# EAGLE design untitled (EAGLE 7.3.2)
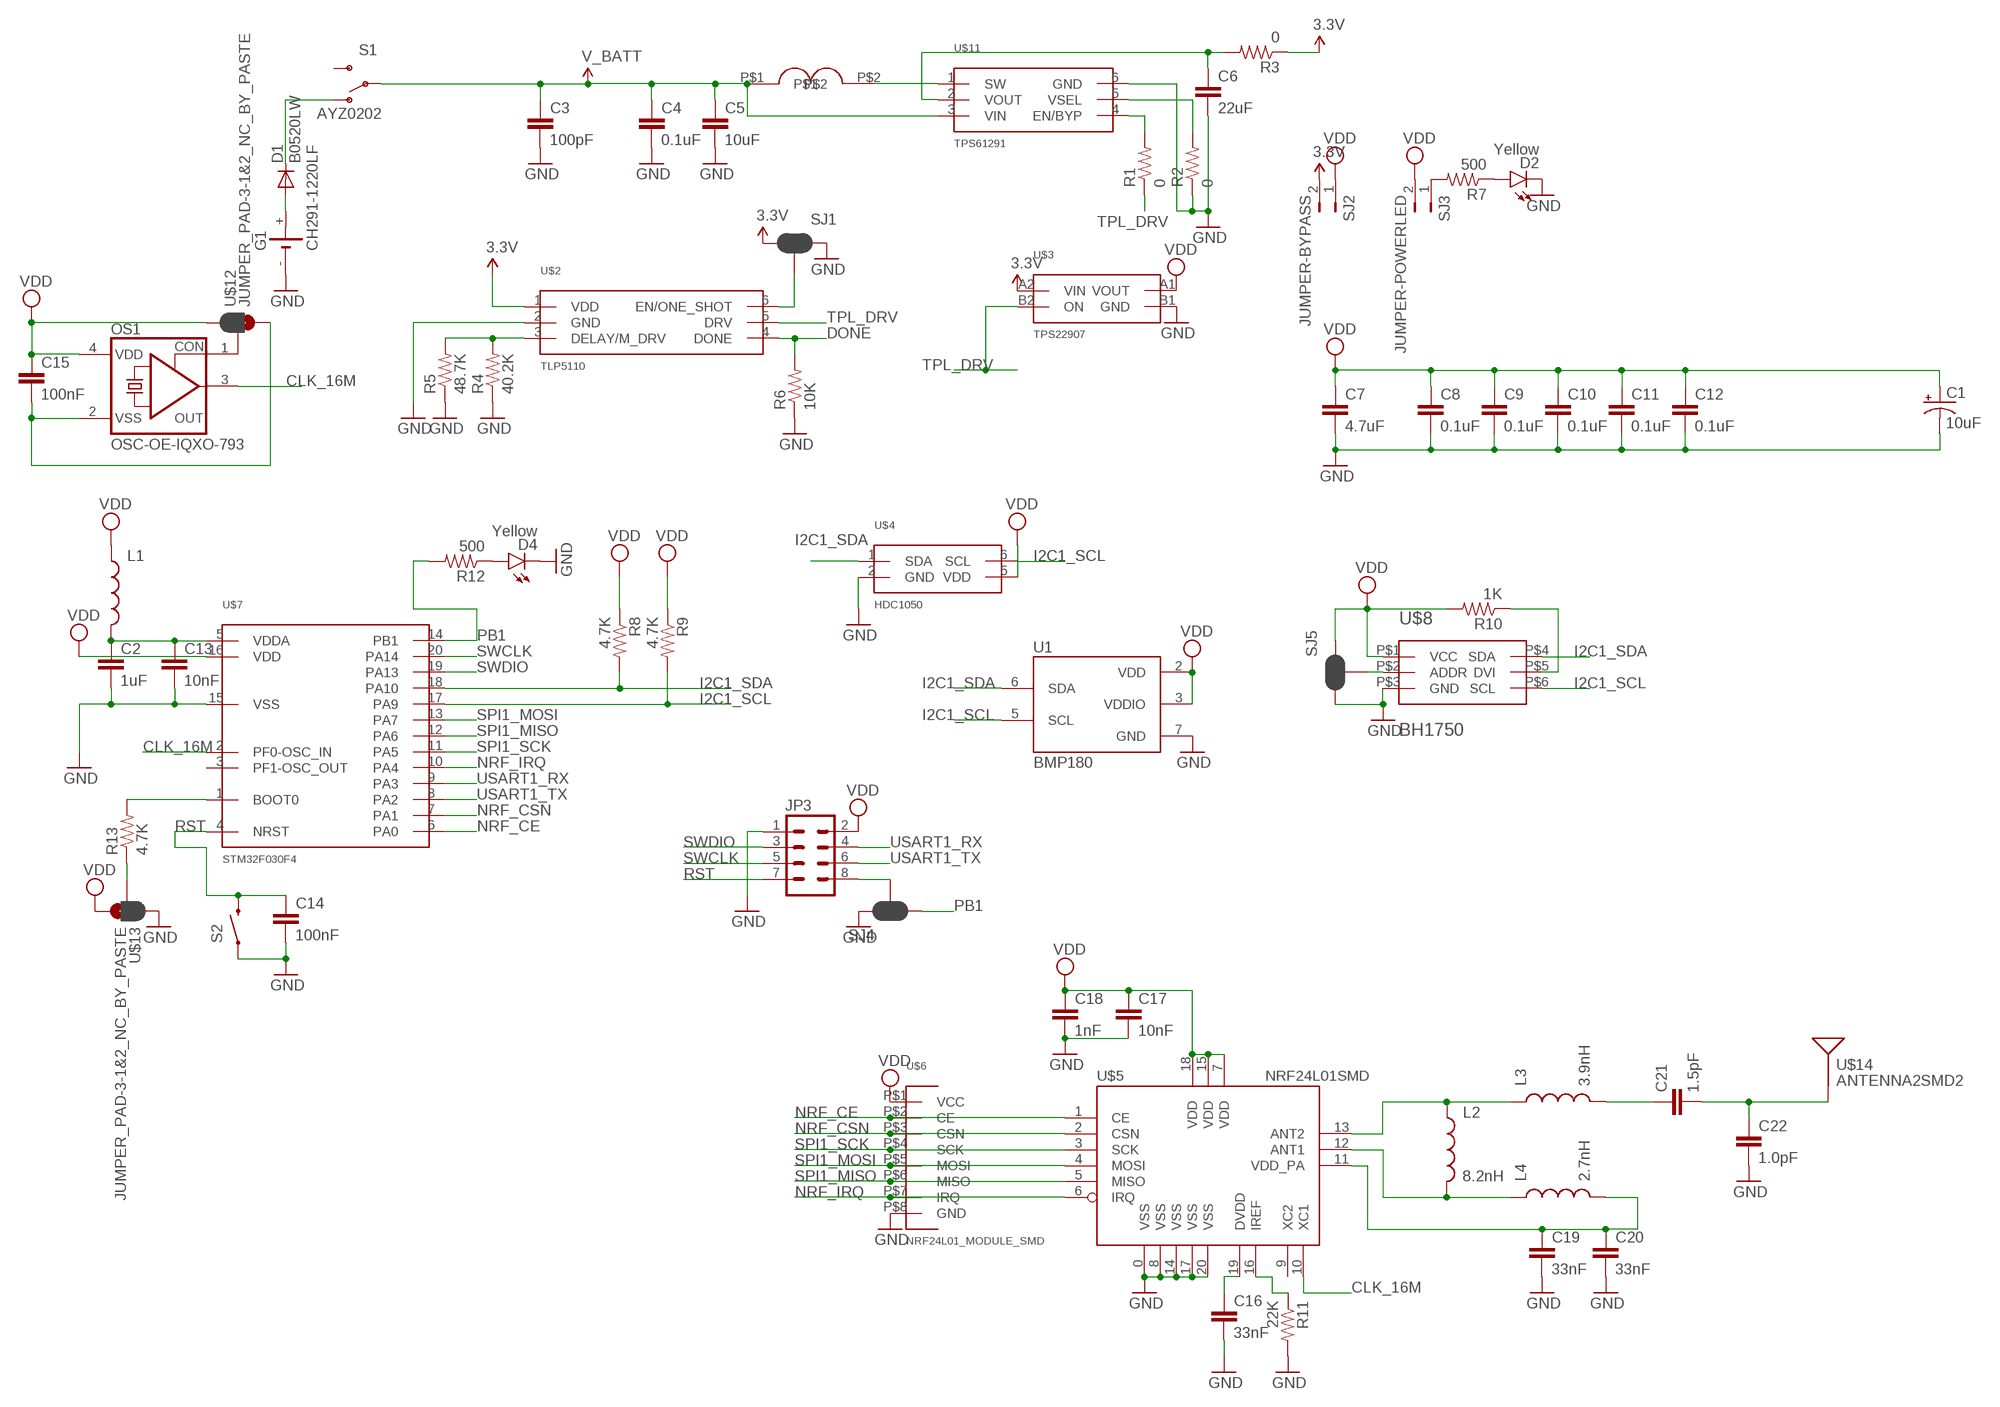
[diagram p0: schematic, sheet 1]

## Parts
C1  10uF  10UF-16V-10%(TANT)  [EIA3216]
C2  1uF  0.1UF-25V-5%(0603)  [0603-CAP]
C3  100pF  100PF-50V-5%(0603)  [0603-CAP]
C4  0.1uF  100PF-50V-5%(0603)  [0603-CAP]
C5  10uF  100PF-50V-5%(0603)  [0603-CAP]
C6  22uF  100PF-50V-5%(0603)  [0603-CAP]
C7  4.7uF  1.0UF-16V-10%(0603)  [0603-CAP]
C8  0.1uF  0.1UF-25V-5%(0603)  [0603-CAP]
C9  0.1uF  0.1UF-25V-5%(0603)  [0603-CAP]
C10  0.1uF  0.1UF-25V-5%(0603)  [0603-CAP]
C11  0.1uF  0.1UF-25V-5%(0603)  [0603-CAP]
C12  0.1uF  0.1UF-25V-5%(0603)  [0603-CAP]
C13  10nF  0.1UF-25V-5%(0603)  [0603-CAP]
C14  100nF  0.1UF-25V-5%(0603)  [0603-CAP]
C15  100nF  0.1UF-25V-5%(0603)  [0603-CAP]
C16  33nF  0.1UF-25V-5%(0603)  [0603-CAP]
C17  10nF  0.1UF-25V-5%(0603)  [0603-CAP]
C18  1nF  0.1UF-25V-5%(0603)  [0603-CAP]
C19  33nF  0.1UF-25V-5%(0603)  [0603-CAP]
C20  33nF  0.1UF-25V-5%(0603)  [0603-CAP]
C21  1.5pF  0.1UF-25V-5%(0603)  [0603-CAP]
C22  1.0pF  0.1UF-25V-5%(0603)  [0603-CAP]
D1  B0520LW  CGRM4001-G  [SOD-123_MINI-SMA]
D2  Yellow  LED-YELLOW0603  [LED-0603]
D4  Yellow  LED-YELLOW0603  [LED-0603]
G1  CH291-1220LF  [CH291-1220LF]
JP3  M04X2SMD  [2X4_SMD]
L1  INDUCTOR0603  [0603]
L2  8.2nH  INDUCTOR0603  [0603]
L3  3.9nH  INDUCTOR0603  [0603]
L4  2.7nH  INDUCTOR0603  [0603]
OS1  OSC-OE-IQXO-793  [2.5X2-4-PAD]
R1  0  1.5KOHM-1/10W-1%(0603)  [0603]
R2  0  1.5KOHM-1/10W-1%(0603)  [0603]
R3  0  1.5KOHM-1/10W-1%(0603)  [0603]
R4  40.2K  0.22OHM-1/4W-1%(0805)  [0805]
R5  48.7K  0.22OHM-1/4W-1%(0805)  [0805]
R6  10K  1.5KOHM-1/10W-1%(0603)  [0603]
R7  500  1.5KOHM-1/10W-1%(0603)  [0603]
R8  4.7K  1.5KOHM-1/10W-1%(0603)  [0603]
R9  4.7K  1.5KOHM-1/10W-1%(0603)  [0603]
R10  1K  1.5KOHM-1/10W-1%(0603)  [0603]
R11  22K  1.5KOHM-1/10W-1%(0603)  [0603]
R12  500  1.5KOHM-1/10W-1%(0603)  [0603]
R13  4.7K  1.5KOHM-1/10W-1%(0603)  [0603]
S1  AYZ0202  SWITCH-SPDTSMD  [AYZ0202]
S2  SWITCH-MOMENTARY-2SMD-REDUNDANT  [TACTILE-SWITCH-SMD]
SJ1  JUMPER-PAD-3-NC_BY_PASTE  [PAD-JUMPER-3-NC_BY_PASTE_YES_SILK_FULL_BOX]
SJ2  JUMPER-BYPASS  JUMPER-PTH-2-NO  [PTH-JUMPER-2-NO_NO_SILK]
SJ3  JUMPER-POWERLED  JUMPER-PTH-2-NO  [PTH-JUMPER-2-NO_NO_SILK]
SJ4  JUMPER-PAD-3-NC_BY_PASTE  [PAD-JUMPER-3-NC_BY_PASTE_YES_SILK_FULL_BOX]
SJ5  JUMPER-PAD-3-NC_BY_PASTE  [PAD-JUMPER-3-NC_BY_PASTE_YES_SILK_FULL_BOX]
U1  BMP180  [BMP180]
U$1  SWPA4018S3R3MT  [SWPA4018S]
U$2  TLP5110  [DDC(R-PDSO-G6)]
U$3  TPS22907  [YZT(S-XBGA-N4)]
U$4  HDC1050  [DMB(S-PWSON-N6)]
U$5  NRF24L01SMD  [QFN20]
U$6  NRF24L01_MODULE_SMD  [M08-1.27]
U$7  STM32F030F4  [TSSOP20]
U$8  BH1750  [WSOF-6]
U$11  TPS61291  [DRV(S-PWSON-N6)]
U$12  JUMPER_PAD-3-1&2_NC_BY_PASTE  [PAD-HUMPER-3-1&2_NC_BY_PASTE_YES_SILK_FULL_BOX]
U$13  JUMPER_PAD-3-1&2_NC_BY_PASTE  [PAD-HUMPER-3-1&2_NC_BY_PASTE_YES_SILK_FULL_BOX]
U$14  ANTENNA2SMD2  [ANTENNA-CHIP3]

## Nets
3.3V: R3.1 SJ1.1 SJ2.2 U$2.1(VDD) U$3.A2(VIN)
CLK_16M: OS1.3(OUT) U$5.10(XC1) U$7.2(PF0-OSC_IN)
DONE: R6.2 U$2.4(DONE)
GND: C1.C(-) C2.2 C3.2 C4.2 C5.2 C6.2 C7.2 C8.2 C9.2 C10.2 C11.2 C12.2 C13.2 C14.2 C16.2 C17.2 C18.2 C19.2 C20.2 C22.2 D2.C D4.C G1.- JP3.1 R2.1 R4.1 R5.1 R6.1 R11.2 S2.1 S2.2 SJ1.3 SJ4.3 SJ5.1 U1.7(GND) U$2.2(GND) U$3.B1(GND) U$4.2(GND) U$5.0(VSS) U$5.8(VSS) U$5.14(VSS) U$5.17(VSS) U$5.20(VSS) U$6.P$8(GND) U$7.15(VSS) U$8.P$3(GND) U$11.6(GND) U$13.1
I2C1_SCL: R9.2 U1.5(SCL) U$4.6(SCL) U$7.17(PA9) U$8.P$6(SCL)
I2C1_SDA: R8.2 U1.6(SDA) U$4.1(SDA) U$7.18(PA10) U$8.P$4(SDA)
MESH: C1.A(+) C7.1 C8.1 C9.1 C10.1 C11.1 C12.1 R8.1 R9.1 R10.2 SJ2.1 SJ3.2 SJ5.3 U1.2(VDD) U1.3(VDDIO) U$6.P$1(VCC) U$8.P$1(VCC) ; supply symbol labelled VDD
N$1: D1.A G1.+
N$2: D1.C S1.1(O)
N$3: U$1.P$2 U$11.1(SW)
N$4: C6.1 R3.2 U$11.2(VOUT)
N$5: R1.2 U$11.4(EN/BYP)
N$6: R2.2 U$11.5(VSEL)
N$7: R4.2 R5.2 U$2.3(DELAY/M_DRV)
N$8: R7.2 SJ3.1
N$9: D2.A R7.1
N$10: SJ1.2 U$2.6(EN/ONE_SHOT)
N$11: L2.1 L3.1 U$5.13(ANT2)
N$12: SJ5.2 U$8.P$2(ADDR)
N$13: R10.1 U$8.P$5(DVI)
N$14: L2.2 L4.1 U$5.12(ANT1)
N$15: D4.A R12.1
N$16: C15.2 OS1.2(VSS) U$12.3
N$17: C2.1 C13.1 L1.2 U$7.5(VDDA)
N$24: C19.1 C20.1 L4.2 U$5.11(VDD_PA)
N$25: R13.1 U$13.2
N$26: JP3.8 SJ4.2
N$27: R13.2 U$7.1(BOOT0)
N$28: OS1.1(CON) U$12.2
N$29: C16.1 U$5.19(DVDD)
N$30: R11.1 U$5.16(IREF)
N$32: C21.1 L3.2
N$33: C21.2 C22.1 U$14.FEED(SIGNAL)
NRF_CE: U$5.1(CE) U$6.P$2(CE) U$7.6(PA0)
NRF_CSN: U$5.2(CSN) U$6.P$3(CSN) U$7.7(PA1)
NRF_IRQ: U$5.6(IRQ) U$6.P$7(IRQ) U$7.10(PA4)
PB1: R12.2 SJ4.1 U$7.14(PB1)
RST: C14.1 JP3.7 S2.3 S2.4 U$7.4(NRST)
SPI1_MISO: U$5.5(MISO) U$6.P$6(MISO) U$7.12(PA6)
SPI1_MOSI: U$5.4(MOSI) U$6.P$5(MOSI) U$7.13(PA7)
SPI1_SCK: U$5.3(SCK) U$6.P$4(SCK) U$7.11(PA5)
SWCLK: JP3.5 U$7.20(PA14)
SWDIO: JP3.3 U$7.19(PA13)
TPL_DRV: R1.1 U$2.5(DRV) U$3.B2(ON)
USART1_RX: JP3.4 U$7.9(PA3)
USART1_TX: JP3.6 U$7.8(PA2)
V_BATT: C3.1 C4.1 C5.1 S1.2(P) U$1.P$1 U$11.3(VIN)
VDD: C15.1 C17.1 C18.1 JP3.2 L1.1 OS1.4(VDD) U$3.A1(VOUT) U$4.5(VDD) U$5.7(VDD) U$5.15(VDD) U$5.18(VDD) U$7.16(VDD) U$12.1 U$13.3
Unconnected: S1.3(S) U$5.9(XC2) U$7.3(PF1-OSC_OUT)

## Library data of the parts
C1 = SparkFun-Capacitors:10UF-16V-10%(TANT): CAP-00811 1206/EIA-3216 Tantalum capacitor; PROD_ID: CAP-00811
C2 C13-C22 = SparkFun-Capacitors:0.1UF-25V-5%(0603): CAP-08604; PROD_ID: CAP-08604; VALUE: 0.1uF
C3 = SparkFun-Capacitors:100PF-50V-5%(0603): CAP-07883; PROD_ID: CAP-07883
C4-C6 = SparkFun-Capacitors:100PF-50V-5%(0603): CAP-07883; PROD_ID: CAP-07883; VALUE: 100pF
C7 = SparkFun-Capacitors:1.0UF-16V-10%(0603): CAP-00868; PROD_ID: CAP-00868; VALUE: 1.0uF
C8-C12 = SparkFun-Capacitors:0.1UF-25V-5%(0603): CAP-08604; PROD_ID: CAP-08604
D1 = diode:CGRM400*-G: Molded plasitc,JEDEC SOD-123/Mini SMA Source: Comchip CGRM4001-G.pdf
D2 D4 = SparkFun-LED:LED-YELLOW: Yellow SMD LEDs LilyPad 1206- DIO-09909 0603- DIO-09003 "SMART" means more efficient and expensive; PROD_ID: DIO-09003
G1 = battery:CH291-1220LF: Battery Holder, SMT, 12mm multicomp PART NO. CH291-1220LF Source: Data sheet <http://www.farnell.com/datasheets/1505860.pdf>
JP3 = SparkFun-Connectors:M04X2: .1" header, two rows of four.
L1-L4 = SparkFun-Passives:INDUCTOR: Inductors Basic Inductor/Choke - 0603 and 1206. Footprints are not proven and vary greatly between part numbers. INDUCTOR POWER 3.3UH 4.0A SMD 0.197" L x 0.197" W x 0.177" H (5.00mm x 5.00mm x 4.50mm)
OS1 = IQD-Frequency-Products:OSC-OE: OSCILLATOR WITH OE
R1-R3 R6-R13 = SparkFun-Resistors:1.5KOHM-1/10W-1%(0603): RES-08306; PROD_ID: RES-08306; VALUE: 1.5KOHM
R4 R5 = SparkFun-Resistors:0.22OHM-1/4W-1%(0805): RES-09883; PROD_ID: RES-09883; VALUE: 0.22
S1 = SparkFun-Electromechanical:SWITCH-SPDT: SPDT Switch Simple slide switch, Spark Fun Electronics SKU : COM-00102 DPDT SMT slide switch, AYZ0202, SWCH-08179; PROD_ID: SWCH-08179; SF_ID: COM-00597
S2 = SparkFun-Electromechanical:SWITCH-MOMENTARY-2: Various NO switches- pushbuttons, reed, etc; PROD_ID: SWCH-08247
SJ1 SJ4 SJ5 = SparkFun-Passives:JUMPER-PAD-3-NC_BY_PASTE
SJ2 SJ3 = SparkFun-Passives:JUMPER-PTH-2-NO
U1 = SparkFun-Sensors:BMP180: BOSCH BMP180 DIGITAL BAROMETRIC PRESSURE SENSOR Web page: http://www.bosch-sensortec.com/en/homepage/products_3/environmental_sensors_1/bmp180_1/bmp180 Datasheet: http://ae-bst.resource.bosch.com/media/products/dokumente/bmp180/BST-BMP180-DS000-09.pdf The BMP180 is the function compatible successor of the BMP085, a new generation of high precision digital pressure sensors for consumer applications. The ultra-low power, low voltage electronics of the BMP180 is optimized for use in mobile phones, PDAs, GPS navigation devices and outdoor equipment. With a low altitude noise of merely 0.25m at fast conversion time, the BMP180 offers superior performance. The I2C interface allows for easy system integration with a microcontroller. The BMP180 is based on piezo-resistive technology for EMC robustness, high accuracy and linearity as well as long term stability. Key features: - Temperature measurement included - I2C interface - Fully calibrated - Pb-free, halogen-free and RoHS compliant, - MSL 1 Basic specs: Pressure range: 300 to 1100hPa (+9000m to -500m relating to sea level) Supply voltage: 1.8 to 3.6V (VDD), 1.62V to 3.6V (VDDIO) Package: LGA package with metal lid Small footprint: 3.6mm x 3.8mm Super-flat: 0.93mm height Low power: 5μA at 1 sample / sec. in standard mode Low noise: 0.06hPa (0.5m) in ultra low power mode, 0.02hPa (0.17m) advanced resolution mode Typical applications: - Enhancement of GPS navigation (dead-reckoning, slope detection, etc.) - In- and out-door navigation - Leisure and sports - Weather forecast - Vertical velocity indication (rise/sink speed)
U$1 = User-Submitted:SWPA4018S3R3MT
U$2 = r1:TLP5110
U$3 = r1:TPS22907
U$4 = r1:HDC1050
U$5 = SparkFun-RF:NRF24L01: 2.4GHz Low Power Transceiver This is the very popular, low cost, very low power RF transceiver from Nordic Semiconductor. Simple SPI interface. SKU: COM-00690
U$6 = User-Submitted:NRF24L01_MODULE_SMD
U$7 = r1:STM32F030F4
U$8 = User-Submitted:BH1750
U$11 = r1:TPS61291
U$12 U$13 = SparkFun-Passives:JUMPER_PAD-3-1&2_NC_BY_PASTE
U$14 = SparkFun-RF:ANTENNA2: Chip antenna Single endded antenna. Common with smaller chip antennas. CHIP4 package is the GPS Chip Antenna SKU: GPS-08418. CHIP5 package is 2.4GHz chip antenna SKU: WRL-00144.

## Board
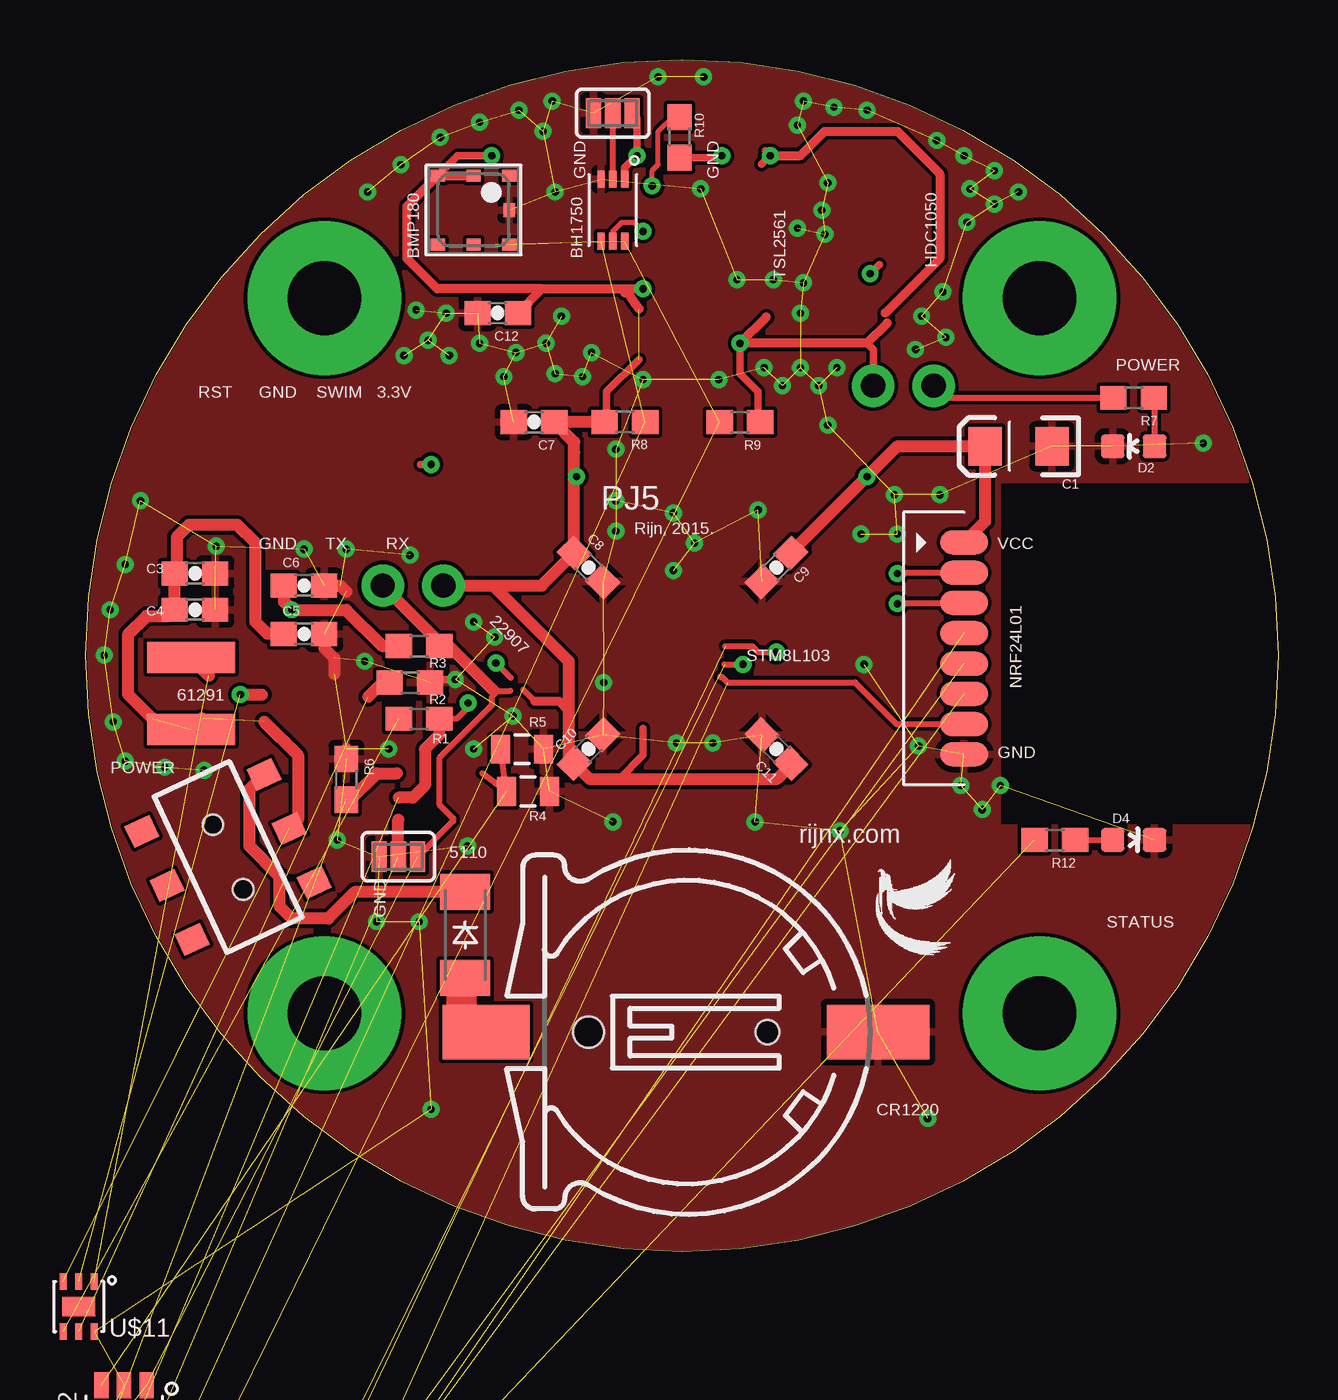
[diagram p1: board, top side]
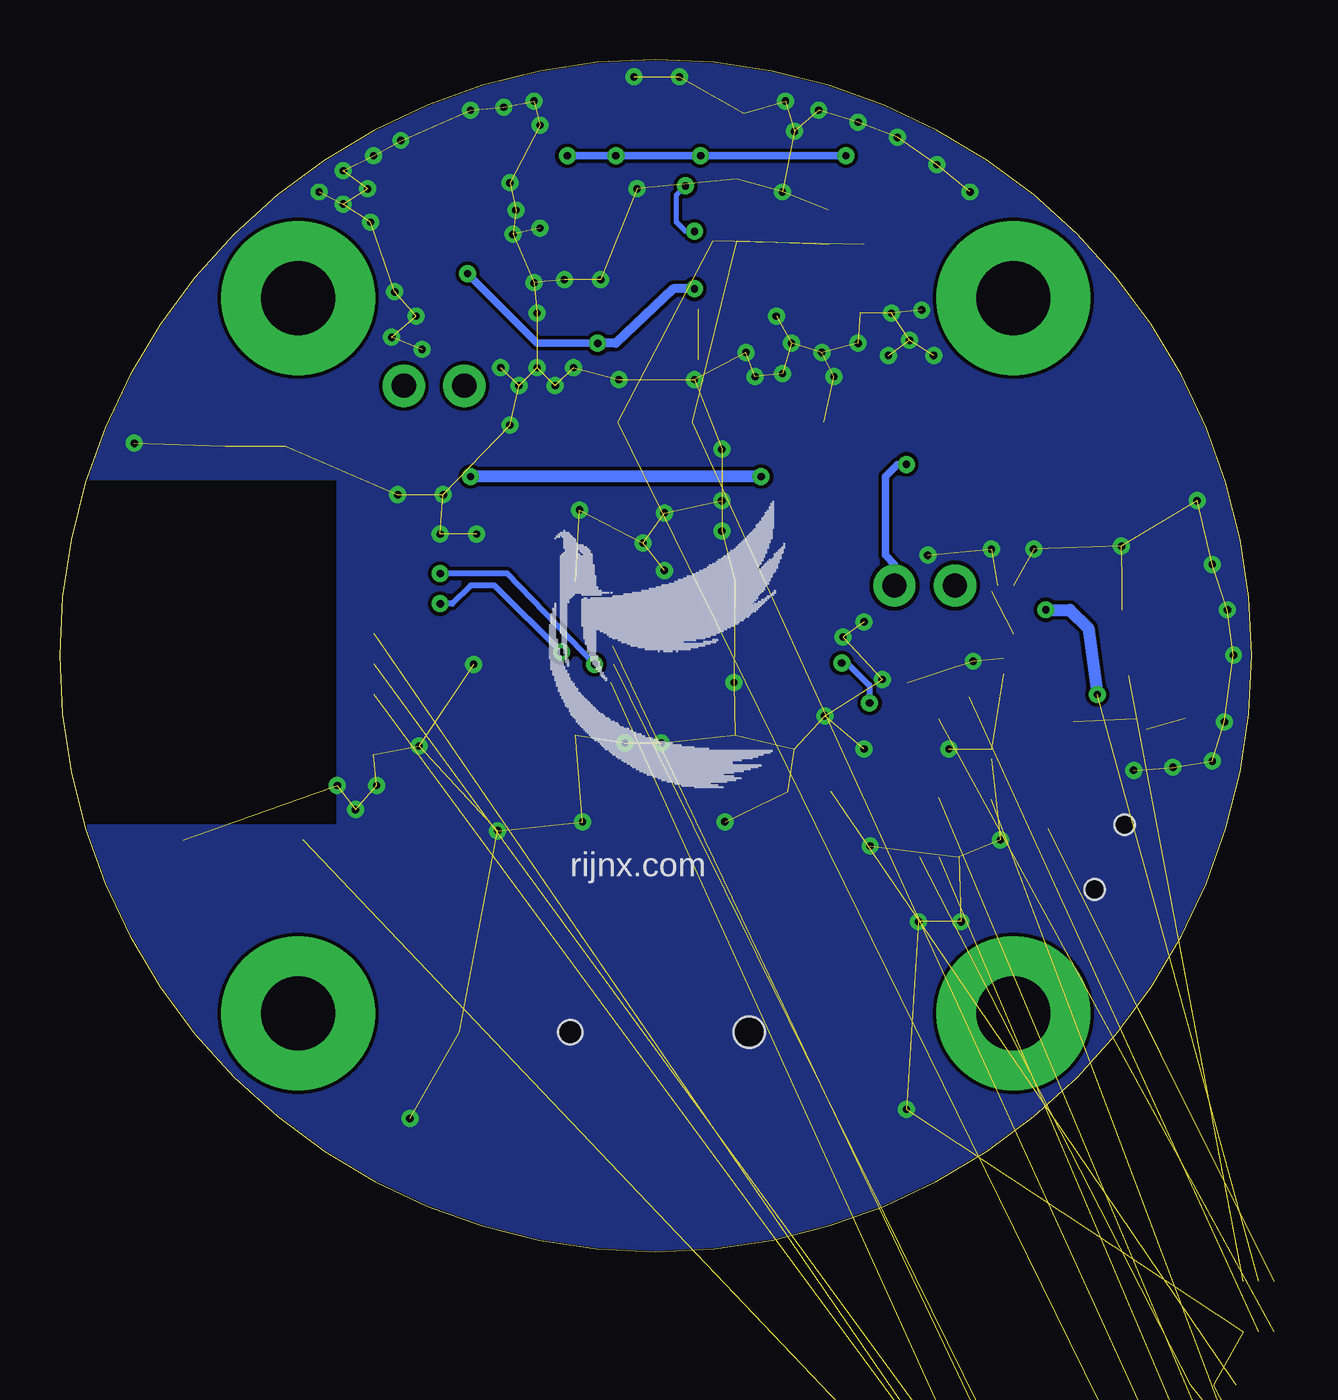
[diagram p2: board, bottom side, seen from below]

Size 50 x 50 mm. Coordinates in mm from the lower left corner, seen from the top.
Outline: 25,50 arc-180 25,0 arc-180 25,50
Copper layers (1*16): Top 0.035mm / dielectric 1.5mm / Bottom 0.035mm
Design rules "default *": minimum track width 6mil, minimum drill 12mil, track to track 6mil, track to pad 6mil, pad to pad 6mil, via to via 6mil, smd to smd 6mil, copper to edge 2mil, drill to drill 6mil, minimum pad ring 10mil, minimum via ring 8mil, stop-mask expansion 4mil, vias tented up to drill 15mil, thermal gap 10mil

### Footprints (pad centres in the part's own frame; a part is rotated, then mirrored left to right if it is on the bottom)
EIA3216 = smd 1.4 x 1.6: A 1.4,0; C -1.4,0
0603-CAP = smd 1.1 x 1: 1 -0.85,0; 2 0.85,0
SOD-123_MINI-SMA = smd 1.5 x 2.1: A 1.8,0; C -1.8,0
LED-0603 = smd 1 x 1: A 0,-0.877; C 0,0.877
CH291-1220LF = smd 2.3 x 3.66: + 0,-2.296 | smd 2.3 x 4.3: - 0,14.146 | hole 1.3: 0,2 | hole 1: 0,9.5
2X4_SMD = smd 1.02 x 1.9: 1 -2.54,-2.85; 2 -2.54,2.85; 3 0,-2.85; 4 0,2.85; 5 2.54,-2.85; 6 2.54,2.85; 7 5.08,-2.85; 8 5.08,2.85
0603 = smd 1.1 x 1: 1 -0.85,0; 2 0.85,0
2.5X2-4-PAD = smd 1.2 x 1: 1 -0.85,-0.65; 2 0.85,-0.65; 3 0.85,0.65; 4 -0.85,0.65
0805 = smd 0.8 x 1.2: 1 -0.9,0; 2 0.9,0
AYZ0202 = smd 1 x 1.15: 1 -2.5,2.825; 2 0,2.825; 3 2.5,2.825; 4 -2.5,-2.825; 5 0,-2.825; 6 2.5,-2.825 | hole 0.85: 1.5,0; -1.5,0
TACTILE-SWITCH-SMD = smd 1.524 x 0.762: 1 -2.794,1.905; 2 2.794,1.905; 3 -2.794,-1.905; 4 2.794,-1.905
PAD-JUMPER-3-NC_BY_PASTE_YES_SILK_FULL_BOX = smd 0.635 x 1.27: 1 -0.813,0; 2 0,0; 3 0.813,0
PTH-JUMPER-2-NO_NO_SILK = drill 1.016 pad 1.778: 1 -1.27,0; 2 1.27,0
BMP180 = smd 0.6 x 0.5: 1 1.5,1.45; 2 0,1.45; 3 -1.5,1.45; 4 -1.5,-1.45; 5 0,-1.45; 6 1.5,-1.45 | smd 0.5 x 0.6: 7 1.5,0
SWPA4018S = smd 1.3 x 3.7: P$1 -1.5,0; P$2 1.5,0
DDC(R-PDSO-G6) = smd 0.6 x 1.1: 1 0.95,1.35; 2 0,1.35; 3 -0.95,1.35; 4 -0.95,-1.35; 5 0,-1.35; 6 0.95,-1.35
YZT(S-XBGA-N4) = smd 0.25 x 0.25: A1 0.25,-0.25; A2 -0.25,-0.25; B1 0.25,0.25; B2 -0.25,0.25
DMB(S-PWSON-N6) = smd 0.5 x 0.8: 1 1,1.5; 2 0,1.5; 3 -1,1.5; 4 -1,-1.5; 5 0,-1.5; 6 1,-1.5 | smd 2.4 x 1.5: P$1 0,0
QFN20 = smd 1 x 1: 0 0,0 | smd 0.65 x 0.3: 1 -1.9,1; 2 -1.9,0.5; 3 -1.9,0; 4 -1.9,-0.5; 5 -1.9,-1; 11 1.9,-1; 12 1.9,-0.5; 13 1.9,0; 14 1.9,0.5; 15 1.9,1 | smd 0.3 x 0.65: 6 -1,-1.9; 7 -0.5,-1.9; 8 0,-1.9; 9 0.5,-1.9; 10 1,-1.9; 16 1,1.9; 17 0.5,1.9; 18 0,1.9; 19 -0.5,1.9; 20 -1,1.9
M08-1.27 = smd 1 x 2: P$1 0,0; P$2 1.27,0; P$3 2.54,0; P$4 3.81,0; P$5 5.08,0; P$6 6.35,0; P$7 7.62,0; P$8 8.89,0
TSSOP20 = smd 0.4 x 1.35: 1 -2.925,-2.875; 2 -2.275,-2.875; 3 -1.625,-2.875; 4 -0.975,-2.875; 5 -0.325,-2.875; 6 0.325,-2.875; 7 0.975,-2.875; 8 1.625,-2.875; 9 2.275,-2.875; 10 2.925,-2.875; 11 2.925,2.875; 12 2.275,2.875; 13 1.625,2.875; 14 0.975,2.875; 15 0.325,2.875; 16 -0.325,2.875; 17 -0.975,2.875; 18 -1.625,2.875; 19 -2.275,2.875; 20 -2.925,2.875
WSOF-6 = smd 0.3 x 0.7: P$1 -0.5,-1.3; P$2 0,-1.3; P$3 0.5,-1.3; P$4 0.5,1.3; P$5 0,1.3; P$6 -0.5,1.3
DRV(S-PWSON-N6) = smd 0.3 x 0.7: 1 0.65,1.05; 2 0,1.05; 3 -0.65,1.05; 4 -0.65,-1.05; 5 0,-1.05; 6 0.65,-1.05 | smd 1.4 x 0.8: NC 0,0
PAD-HUMPER-3-1&2_NC_BY_PASTE_YES_SILK_FULL_BOX = smd 0.635 x 1.27: 1 -0.813,0; 2 0,0; 3 0.813,0
ANTENNA-CHIP3 = smd 1.8 x 1.5: FEED 0,4.5; NC 0,-4.5

### Placement (x,y rotation side)
C1  39.12,33.78 180 top
C2  -6.9,-38.51 0 top  (outside the outline)
C3  4.57,28.45 0 top
C4  4.57,26.92 0 top
C5  9.14,25.91 0 top
C6  9.14,27.94 0 top
C7  18.8,34.8 180 top
C8  21.08,28.7 315 top
C9  28.96,28.7 225 top
C10  21.08,21.08 45 top
C11  28.96,21.08 135 top
C12  17.27,39.37 180 top
C13  -6.9,-41.47 0 top  (outside the outline)
C14  -6.9,-52.03 0 top  (outside the outline)
C15  -6.9,-67.48 0 top  (outside the outline)
C16  -13.65,-73.39 0 top  (outside the outline)
C17  -13.65,-76.35 0 top  (outside the outline)
C18  -13.65,-79.31 0 top  (outside the outline)
C19  -13.65,-89.88 0 top  (outside the outline)
C20  -13.65,-92.84 0 top  (outside the outline)
C21  -13.65,-95.8 0 top  (outside the outline)
C22  -13.65,-98.76 0 top  (outside the outline)
D1  15.91,13.29 270 top
D2  43.94,33.78 90 top
D4  43.94,17.27 270 top
G1  19.08,9.21 270 top
JP3  2.35,-19.11 0 top  (outside the outline)
L1  -6.9,-44.42 0 top  (outside the outline)
L2  -13.65,-82.27 0 top  (outside the outline)
L3  -13.65,-84.59 0 top  (outside the outline)
L4  -13.65,-86.92 0 top  (outside the outline)
OS1  -4.43,-62.12 0 top  (outside the outline)
R1  13.97,22.35 180 top
R2  13.59,23.88 180 top
R3  13.97,25.4 180 top
R4  18.54,19.3 180 top
R5  18.29,21.08 180 top
R6  10.92,19.81 270 top
R7  43.94,35.81 180 top
R8  22.61,34.8 0 top
R9  27.43,34.8 180 top
R10  24.89,46.74 270 top
R11  -13.65,-70.43 0 top  (outside the outline)
R12  40.64,17.27 180 top
R13  -3.52,-35.55 0 top  (outside the outline)
S1  5.96,16.56 295 top
S2  -4.76,-48.08 0 top  (outside the outline)
SJ1  13.1,16.57 180 top
SJ2  13.72,27.94 180 top
SJ3  34.29,36.32 180 top
SJ4  -3.26,-20.6 0 top  (outside the outline)
SJ5  22.1,47.75 0 top
U1  16.26,43.69 0 top
U$1  4.41,23.41 90 top
U$2  1.6,-6.95 0 top  (outside the outline)
U$3  -0.65,-9.72 0 top  (outside the outline)
U$4  1.26,-13.2 0 top  (outside the outline)
U$5  -6.08,-56.02 0 top  (outside the outline)
U$6  36.83,29.75 270 top
U$7  -0.22,-26.67 0 top  (outside the outline)
U$8  22.1,43.69 180 top
U$9  [LOGO-3]  29.51,19.41 0 bottom
U$10  [LOGO-1]  33.12,12.43 0 top
U$11  -0.3,-2.3 0 top
U$12  -10.02,-66.71 0 top  (outside the outline)
U$13  -13.4,-66.71 0 top  (outside the outline)
U$14  -16.28,-95.05 0 top  (outside the outline)

### Tracks (layer width: path | path; a pad name or v marks a point on that pad's centre or on a via)
3.3V  (2 unrouted)
  Top 0.254: 17.02,23.62 17.17,23.62 17.27,23.52 | 17.27,23.52 17.8,23.52 | 17.27,23.52 17.04,23.29 17.04,22.94 14.83,20.73 14.83,18.75 15.4,18.17 15.4,18.06 SJ1.1
  Top 0.508: SJ2.2 14.82,25.57 R3.1 15.24,25.4 17.02,23.62
CLK_16M  (2 unrouted)
DONE  (1 unrouted)
  Top 0.508: R6.2 11.09,18.96 12.19,20.07 13.04,20.07
GND  (via drill 0.3)  (149 unrouted)
  Top 0.305: R2.1 14.95,24 v15.49,24
  Top 0.508: C5.2 9.99,25.31 10.41,24.89 10.41,24.24 | C6.2 10.67,27.94 10.92,27.69 | R6.1 10.92,21.08
  other vias: 11.68,24.77 21.21,37.72 19.68,36.83 18.03,37.72 14.35,38.23 11.81,44.45 19.68,44.45 30.1,48.26 30.1,40.64 25.78,44.58 16.26,26.42 17.14,25.78 22.23,31.5 22.23,30.23 22.23,33.66 2.29,31.5 5.46,29.59 17.91,22.48 21.72,23.88 24.77,21.34 26.29,21.34 31.62,17.65 14.48,5.97 35.31,5.59 28.19,31.11 24.64,30.99 25.53,29.72 24.64,28.57 22.1,18.03 28.07,18.03 32.51,30.1 32.64,24.64 34.92,21.21 34.04,30.1 33.91,31.75 35.81,31.75 46.86,33.91 36.7,19.56 38.35,19.56 37.59,18.54 1.65,28.83 1.02,26.92 0.76,25.02 1.14,22.23 1.65,20.57 3.3,20.32 4.95,20.19 10.54,17.27 9.14,29.46 10.92,29.46 13.59,29.21 12.19,13.84 13.97,13.84 16,17.02 16.26,21.08 31.11,34.67 13.21,45.59 14.86,46.74 16.51,47.37 18.16,47.88 19.56,48.26 19.18,46.99 24,49.28 25.91,49.28 31.37,48.01 32.77,47.88 29.84,47.24 35.69,46.61 36.83,45.97 38.1,45.34 39.12,44.45 37.08,44.58 38.1,43.94 36.96,43.18 35.94,40.26 35.05,39.24 36.07,38.35 34.8,37.85 13.84,39.5 15.11,39.37 13.34,37.59 15.24,37.59 16.51,38.1 17.53,36.7 19.94,39.24 19.3,38.1 20.83,36.7 23.37,36.58 26.54,36.58 28.45,37.08 29.21,36.32 29.97,37.08 30.73,36.32 31.5,37.08 30.86,43.69 29.84,42.93 30.99,42.67 27.3,40.77 28.83,40.77 29.97,39.37 12.7,21.08 31.11,44.83
  pour Top: -1.27,51.31 50.8,51.31 50.8,32.38 38.23,32.38 38.23,17.78 50.93,17.78 50.93,-0.64 -1.27,-0.64
  pour Bottom: 0.13,53.72 53.09,53.72 53.09,32.51 38.23,32.51 38.23,17.78 50.93,17.78 50.93,-0.51 -0.38,-0.51 -0.38,53.72
I2C1_SCL  (4 unrouted)
I2C1_SDA  (4 unrouted)
MESH  (via drill 0.3)  (1 unrouted)
  Top 0.178: v20.57,32.51 20.48,32.6 20.48,33.53
  Top 0.254: 18.35,23.56 18.82,23.09
  Top 0.305: U$8.P$1 22.6,45.46 v23.11,45.97 23.11,47.55 SJ5.3 | v17.02,45.97 15.59,45.97 U1.3 | 28.34,45.61 v28.7,45.97 28.5,46.18 | 33.27,41.4 v32.89,41.02 | R10.2 26.58,45.89 v26.67,45.97 | 23.2,37.43 21.84,36.07 21.84,34.89 R8.1 | v27.43,38.1 27.43,36.83 28.19,36.07 28.19,34.89 R9.1 | SJ3.2 33.02,37.85 32.77,38.1 | 23.37,21.95 23.37,20.83 22.35,19.81 | 14.03,33.02 v14.48,33.02
  Top 0.381: 18.82,23.09 19.84,23.09 20.24,22.68 | C12.1 19.14,40.39 | 19.14,40.39 22.61,40.39 | 22.61,40.39 23.2,39.54 | 22.61,40.22 22.61,40.39 | 22.61,40.39 v23.37,40.39 | 28.54,39.2 v27.43,38.1 32.77,38.1 33.62,38.95 | 19.14,40.39 14.73,40.39 13.46,41.66 13.46,43.84 U1.3 U1.2 | v28.7,45.97 29.97,45.97 30.99,46.99 34.04,46.99 35.81,45.21 35.81,41.66 33.53,39.37
  Top 0.508: C9.1 v32.77,32.51 34.04,33.78 C1.A 37.72,30.64 U$6.P$1 | R8.1 C7.1 20.48,33.96 20.48,33.53 C8.1 19.12,27.94 SJ2.1 17.07,27.94 20.24,24.77 20.24,22.68 20.24,20.72 C10.1 21.15,19.81 22.35,19.81 28.96,19.81 29.56,20.41 C11.1
  Bottom 0.305: v17.02,45.97 v23.11,45.97 v26.67,45.97 v28.7,45.97 | v32.89,41.02 29.97,38.1 v27.43,38.1 | v14.48,33.02 14.86,33.02 15.37,32.51 15.37,29.21 14.99,28.83 SJ2.1
  Bottom 0.381: v23.37,40.39 24.26,40.39 26.67,38.1 v27.43,38.1
  Bottom 0.508: v20.57,32.51 v32.77,32.51
N$1
  Top 1.27: D1.A 15.75,11.49 15.75,9.65 16.79,9.65 G1.+
N$2
  Top 0.508: D1.C 11.28,15.09 10.16,13.97 8.64,13.97 8.13,14.48 8.13,15.75 6.86,17.02 6.86,19.41 S1.1
N$3  (1 unrouted)
  Top 0.508: 5.16,24.17 U$1.P$2
N$4  (via drill 0.3)  (1 unrouted)
  Top 0.508: C6.1 8.29,27.27 v8.64,26.92 10.92,26.92 12.45,25.4 R3.2 | v6.48,23.37 7.38,23.37
  Bottom 0.508: v8.64,26.92 7.62,26.92 6.86,26.16 v6.48,23.37
N$5  (1 unrouted)
  Top 0.508: 13.11,22.37 R1.2
N$6  (1 unrouted)
  Top 0.508: 11.84,23.27 12.45,23.88 R2.2
N$7  (1 unrouted)
  Top 0.254: 16.62,20.07 R4.2 R5.2
N$8
  Top 0.254: SJ3.1 36.07,35.81 R7.2
N$9
  Top 0.254: R7.1 44.82,35.79 D2.A
N$10  (1 unrouted)
  Top 0.508: SJ1.2 13.1,18.12
N$11  (2 unrouted)
N$12
  Top 0.254: U$8.P$2 SJ5.2
N$13  (via drill 0.3)
  Top 0.203: U$8.P$5 22.1,42.8 22.48,43.18 22.99,43.18 v23.37,42.8 | v23.75,44.7 23.75,45.34 24,45.59 24,46.99 24.6,47.59 R10.1
  Bottom 0.203: v23.37,42.8 23.75,42.8 24.13,43.18 24.13,44.32 v23.75,44.7
N$14  (2 unrouted)
N$15
  Top 0.254: R12.1 D4.A
N$16  (2 unrouted)
N$17  (3 unrouted)
N$18  (via drill 3.1 pad 6.45)
  other vias: 40,40
N$19  (via drill 3.1 pad 6.45)
  other vias: 40,10
N$20  (via drill 3.1 pad 6.45)
  other vias: 10,10
N$21  (via drill 3.1 pad 6.45)
  other vias: 10,40
N$24  (3 unrouted)
N$25  (1 unrouted)
N$26  (1 unrouted)
N$27  (1 unrouted)
N$28  (1 unrouted)
N$29  (1 unrouted)
N$30  (1 unrouted)
N$32  (1 unrouted)
N$33  (2 unrouted)
NRF_CE  (via drill 0.3)  (2 unrouted)
  Top 0.254: 26.78,24.64 v27.56,24.64 | v34.04,28.45 34.07,28.48 U$6.P$2
  Bottom 0.254: v27.56,24.64 31.24,28.45 v34.04,28.45
NRF_CSN  (via drill 0.3)  (2 unrouted)
  Top 0.254: 26.81,25.4 27.94,25.4 28.19,25.15 v28.96,25.15 | v34.04,27.18 34.07,27.21 U$6.P$3
  Bottom 0.254: v28.96,25.15 31.75,27.94 32.77,27.94 33.53,27.18 v34.04,27.18
NRF_IRQ  (2 unrouted)
  Top 0.254: 26.6,24.11 26.67,24.11 26.9,23.88 32.26,23.88 34,22.13 U$6.P$7
PB1  (2 unrouted)
RST  (4 unrouted)
SPI1_MISO  (2 unrouted)
SPI1_MOSI  (2 unrouted)
SPI1_SCK  (2 unrouted)
SWCLK  (1 unrouted)
SWDIO  (1 unrouted)
TPL_DRV  (via drill 0.3)  (2 unrouted)
  Top 0.254: 17.82,24.06 v17.2,24.69 | v16.03,23.01 16.03,22.84 15.54,22.35 R1.1
  Top 0.508: R1.1 14.82,21.68 14.22,21.08 14.22,19.56 13.72,19.05 13.12,19.05
  Bottom 0.254: v17.2,24.69 16.97,24.69 16.03,23.75 v16.03,23.01
USART1_RX  (1 unrouted)
USART1_TX  (1 unrouted)
V_BATT  (3 unrouted)
  Top 0.508: 4.87,22.37 U$1.P$1 | 7.48,22.23 8.89,20.83 8.89,18.12 S1.2 | 2.78,22.37 1.78,23.37 1.78,25.91 2.54,26.67 3.47,26.67 C4.1 C3.1 3.81,28.54 3.81,29.97 4.32,30.48 6.35,30.48 7.11,29.72 7.11,26.42 7.62,25.91 C5.1
VDD  (13 unrouted)

### Text on the board
tNames: GND | GND | BMP180 | BH1750 | TSL2561 | HDC1050 | POWER | RST | GND | SWIM | 3.3V | PJ5 | Rijn, 2015. | GND | TX | RX | VCC | 22907 | STM8L103 | NRF24L01 | 61291 | GND | POWER | 5110 | rijnx.com | GND | STATUS | CR1220
bNames: rijnx.com